# Altium schematic sheet GSG_TX.SchDoc
size A4; SheetNumber: 24; SheetTotal: 27
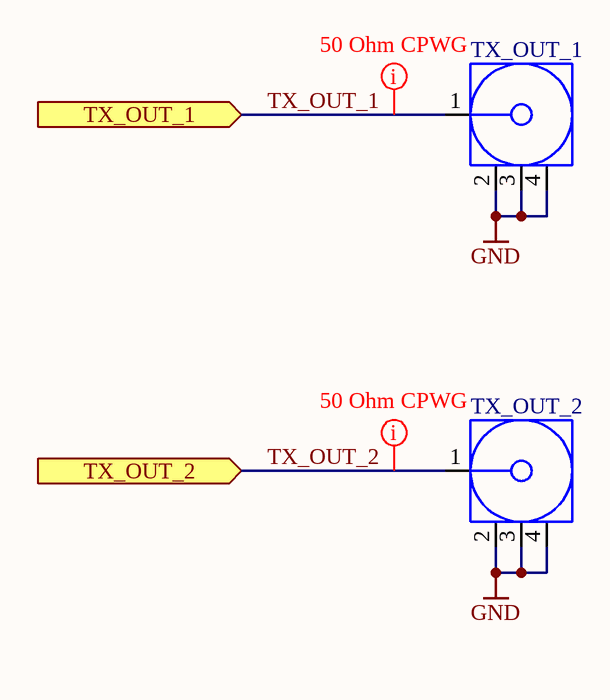
[diagram p0: GSG_TX.SchDoc]

## Parts
TX_OUT_1  60312862112552  [60312862112552]  (value not drawn)
TX_OUT_2  60312862112552  [60312862112552]  (value not drawn)

## Ports
TX_OUT_1 (in, see Top_Level[7B], TX_RUBVERANO[8C]), TX_OUT_2 (in, see Top_Level[7B], TX_RUBVERANO[1C])

## Nets
GND: TX_OUT_1.2(GND) TX_OUT_1.3(GND) TX_OUT_1.4(GND) TX_OUT_2.2(GND) TX_OUT_2.3(GND) TX_OUT_2.4(GND)
TX_OUT_1: TX_OUT_1.1(Signal) ; port TX_OUT_1
TX_OUT_2: TX_OUT_2.1(Signal) ; port TX_OUT_2

## Layout directives
net class 50Ohm_CPWG: TX_OUT_1, TX_OUT_2

## Library data of the parts
TX_OUT_1 TX_OUT_2 = X000012: WR-SMA Connector, PCB Solderless, DC~18GHz, 50Ohm; Manufacturer: Würth; Center Contact Diameter: 0.25mm; Connector Type: SMA; Gender: Jack; Interface Type: MIL-STD-348; Manufacturer Part Number: 60312862112552; Category: Coaxial Connectors; Match Code: WR-SMA; ComponentLink1Description: Datasheet; ComponentLink1URL: https://www.we-online.com/components/products/datasheet/60312862112552.pdf; ComponentLink2Description: Datasheet Link; ComponentLink2URL: https://www.we-online.com/redexpert/spec/60312862112552?ad; Mount: Screw; Operating Temperature Max: 165°C; Operating Temperature Min: -65°C; Packaging: Tray; Frequency Range: DC~18GHz; Impedance: 50Ohm; Orientation: Right Angle; ID: X000012; Type: SMA Solderless Würth; Part Value: 60312862112552